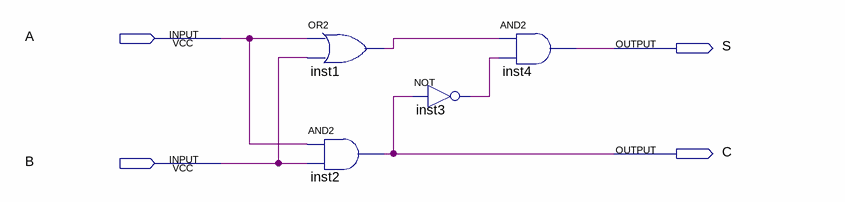
[diagram p0: schematic sheet]
// Quartus schematic half_adder.bdf as structural Verilog: 4 symbols, 4 pins
module half_adder (
  input  A,
  input  B,
  output S,
  output C
);

  wire inst1_out, inst3_out;

  or inst1 (inst1_out, A, B);
  and inst2 (C, A, B);
  not inst3 (inst3_out, C);
  and inst4 (S, inst1_out, inst3_out);
endmodule
